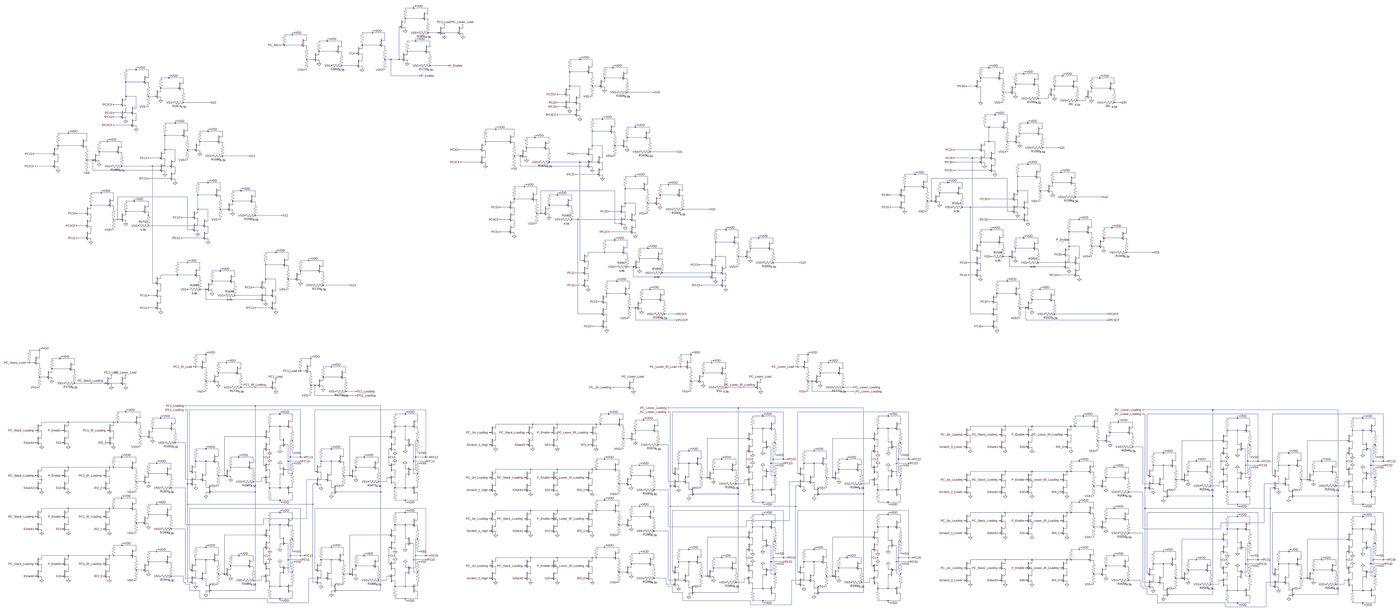
[diagram p0: schematic program_counter.asc, whole sheet]
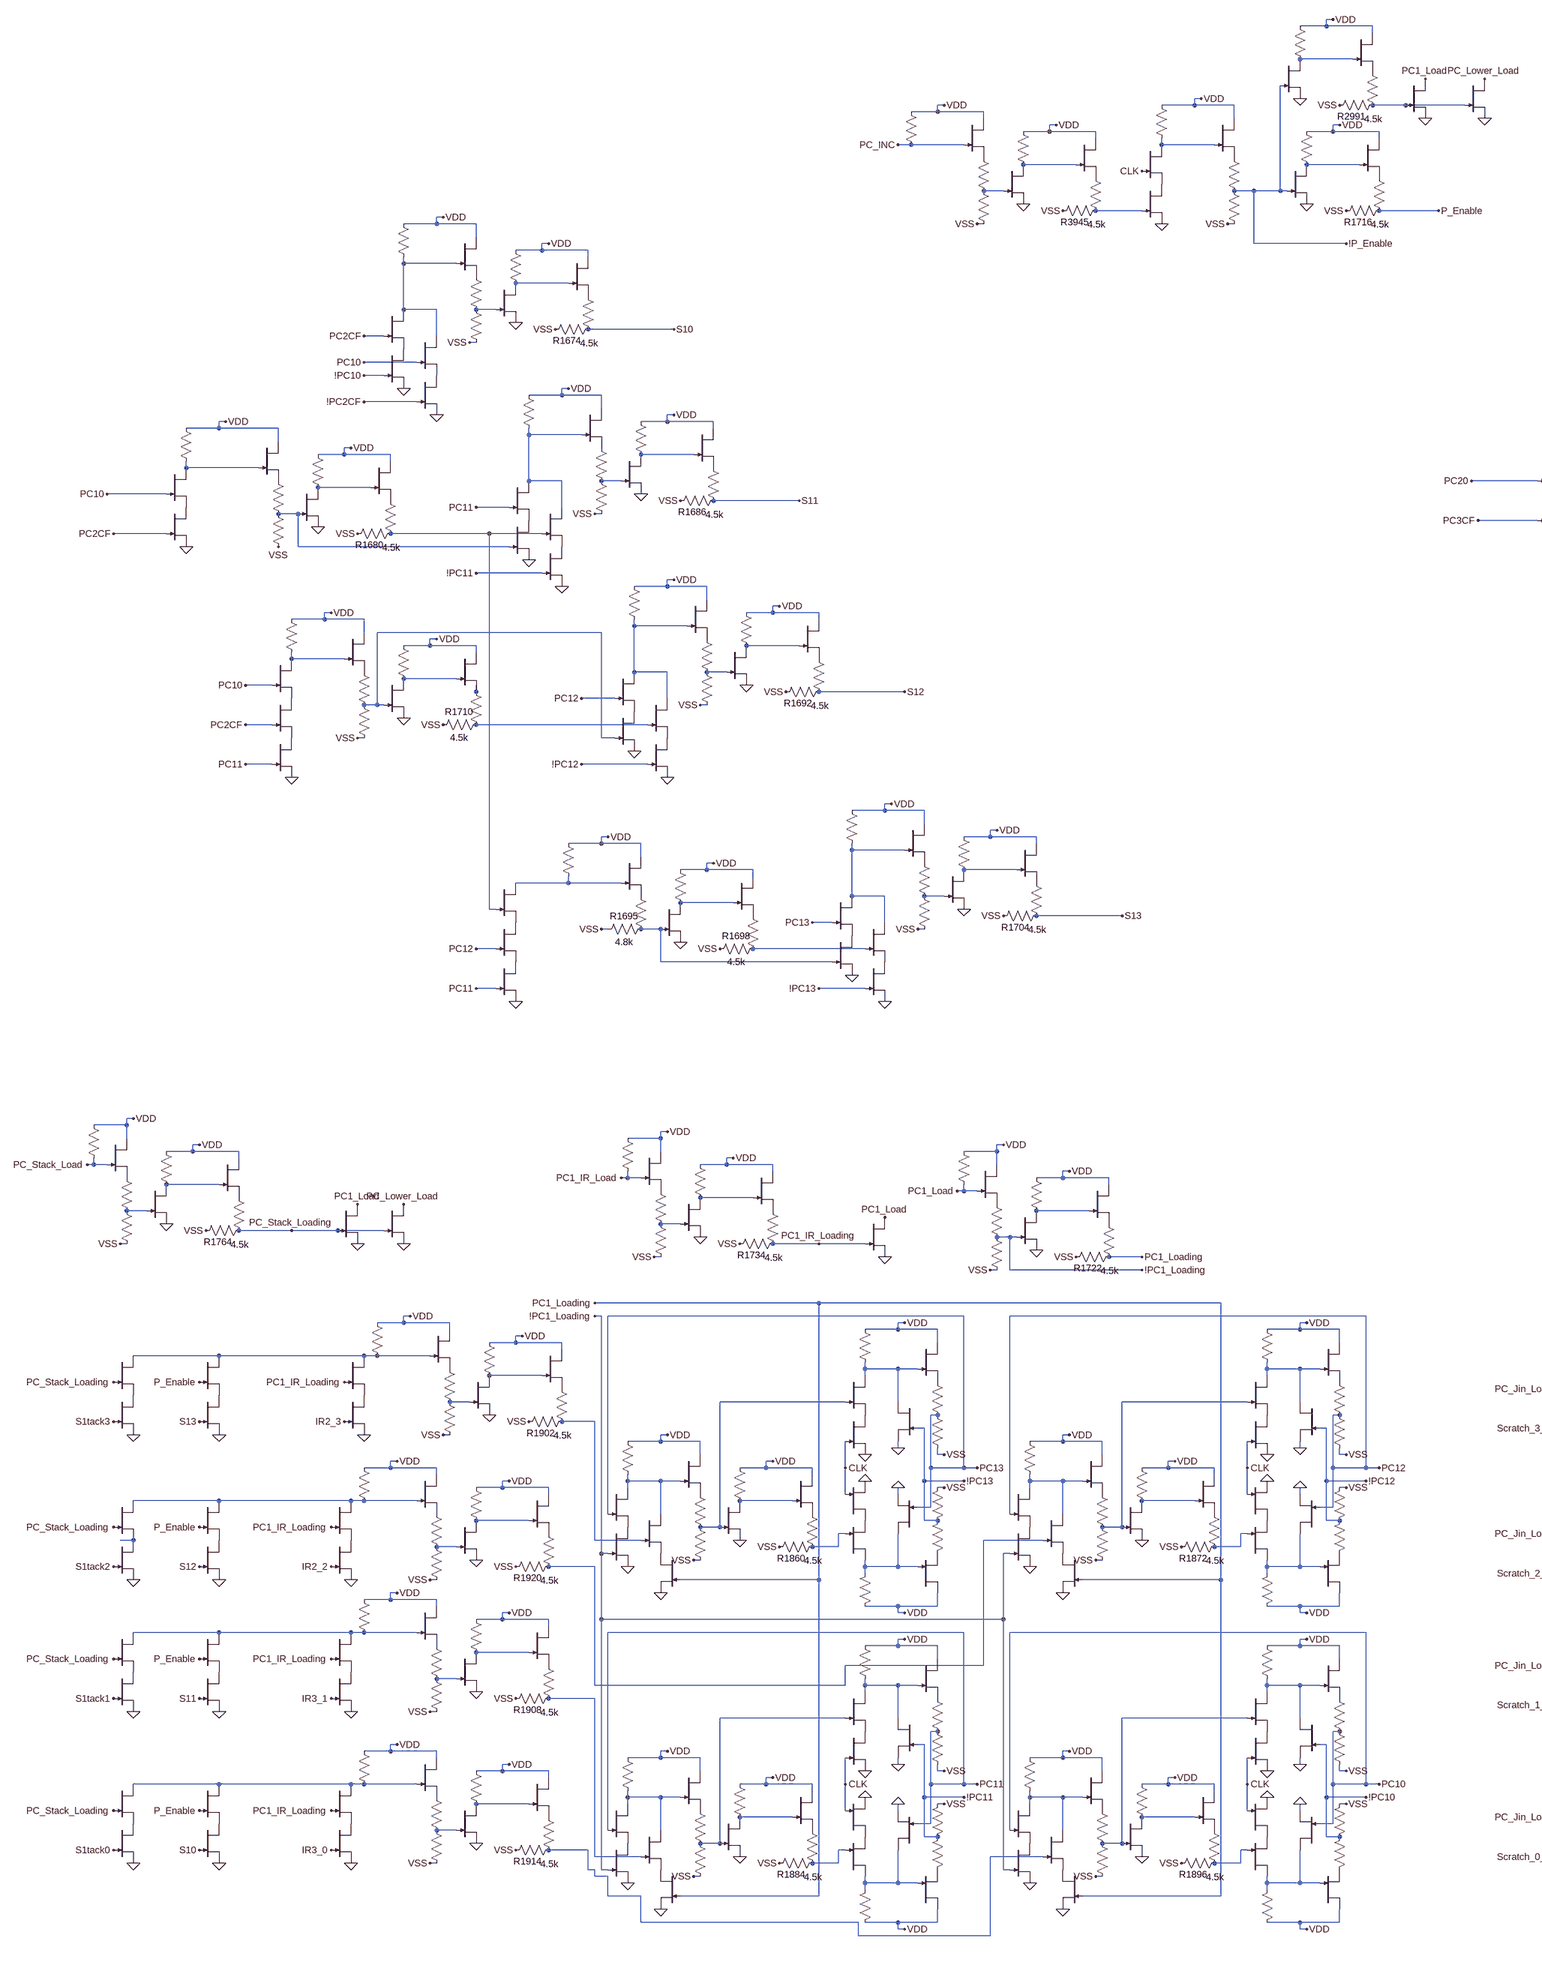
[diagram p1: schematic program_counter.asc, part, row 1 of 1, column 1 of 3]
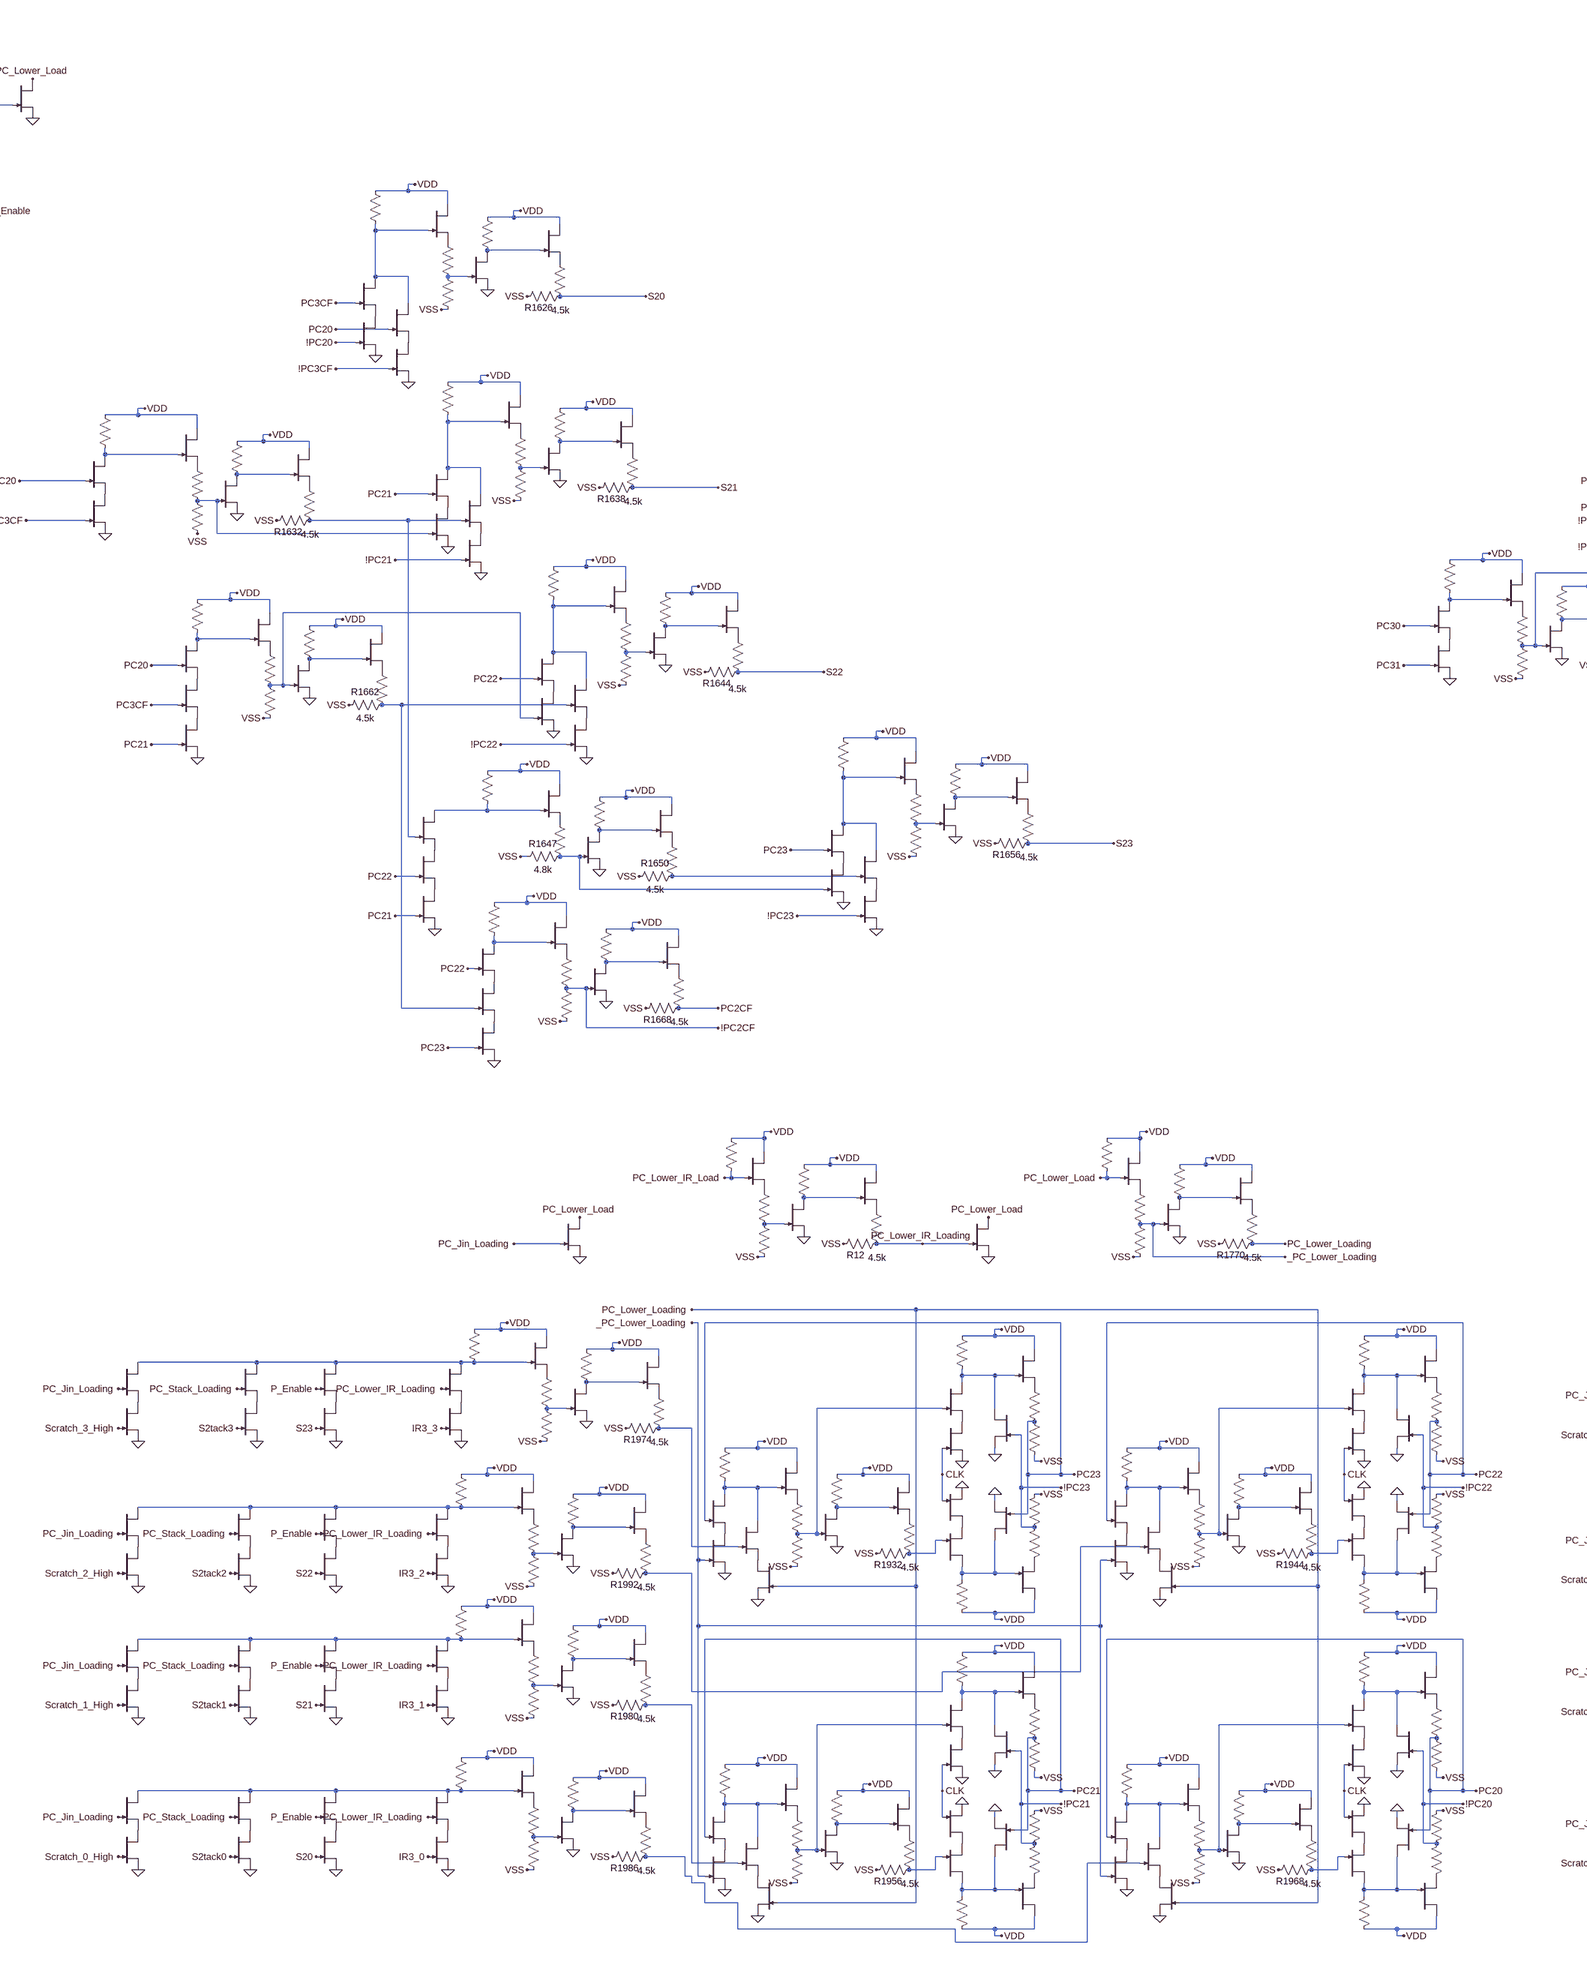
[diagram p2: schematic program_counter.asc, part, row 1 of 1, column 2 of 3]
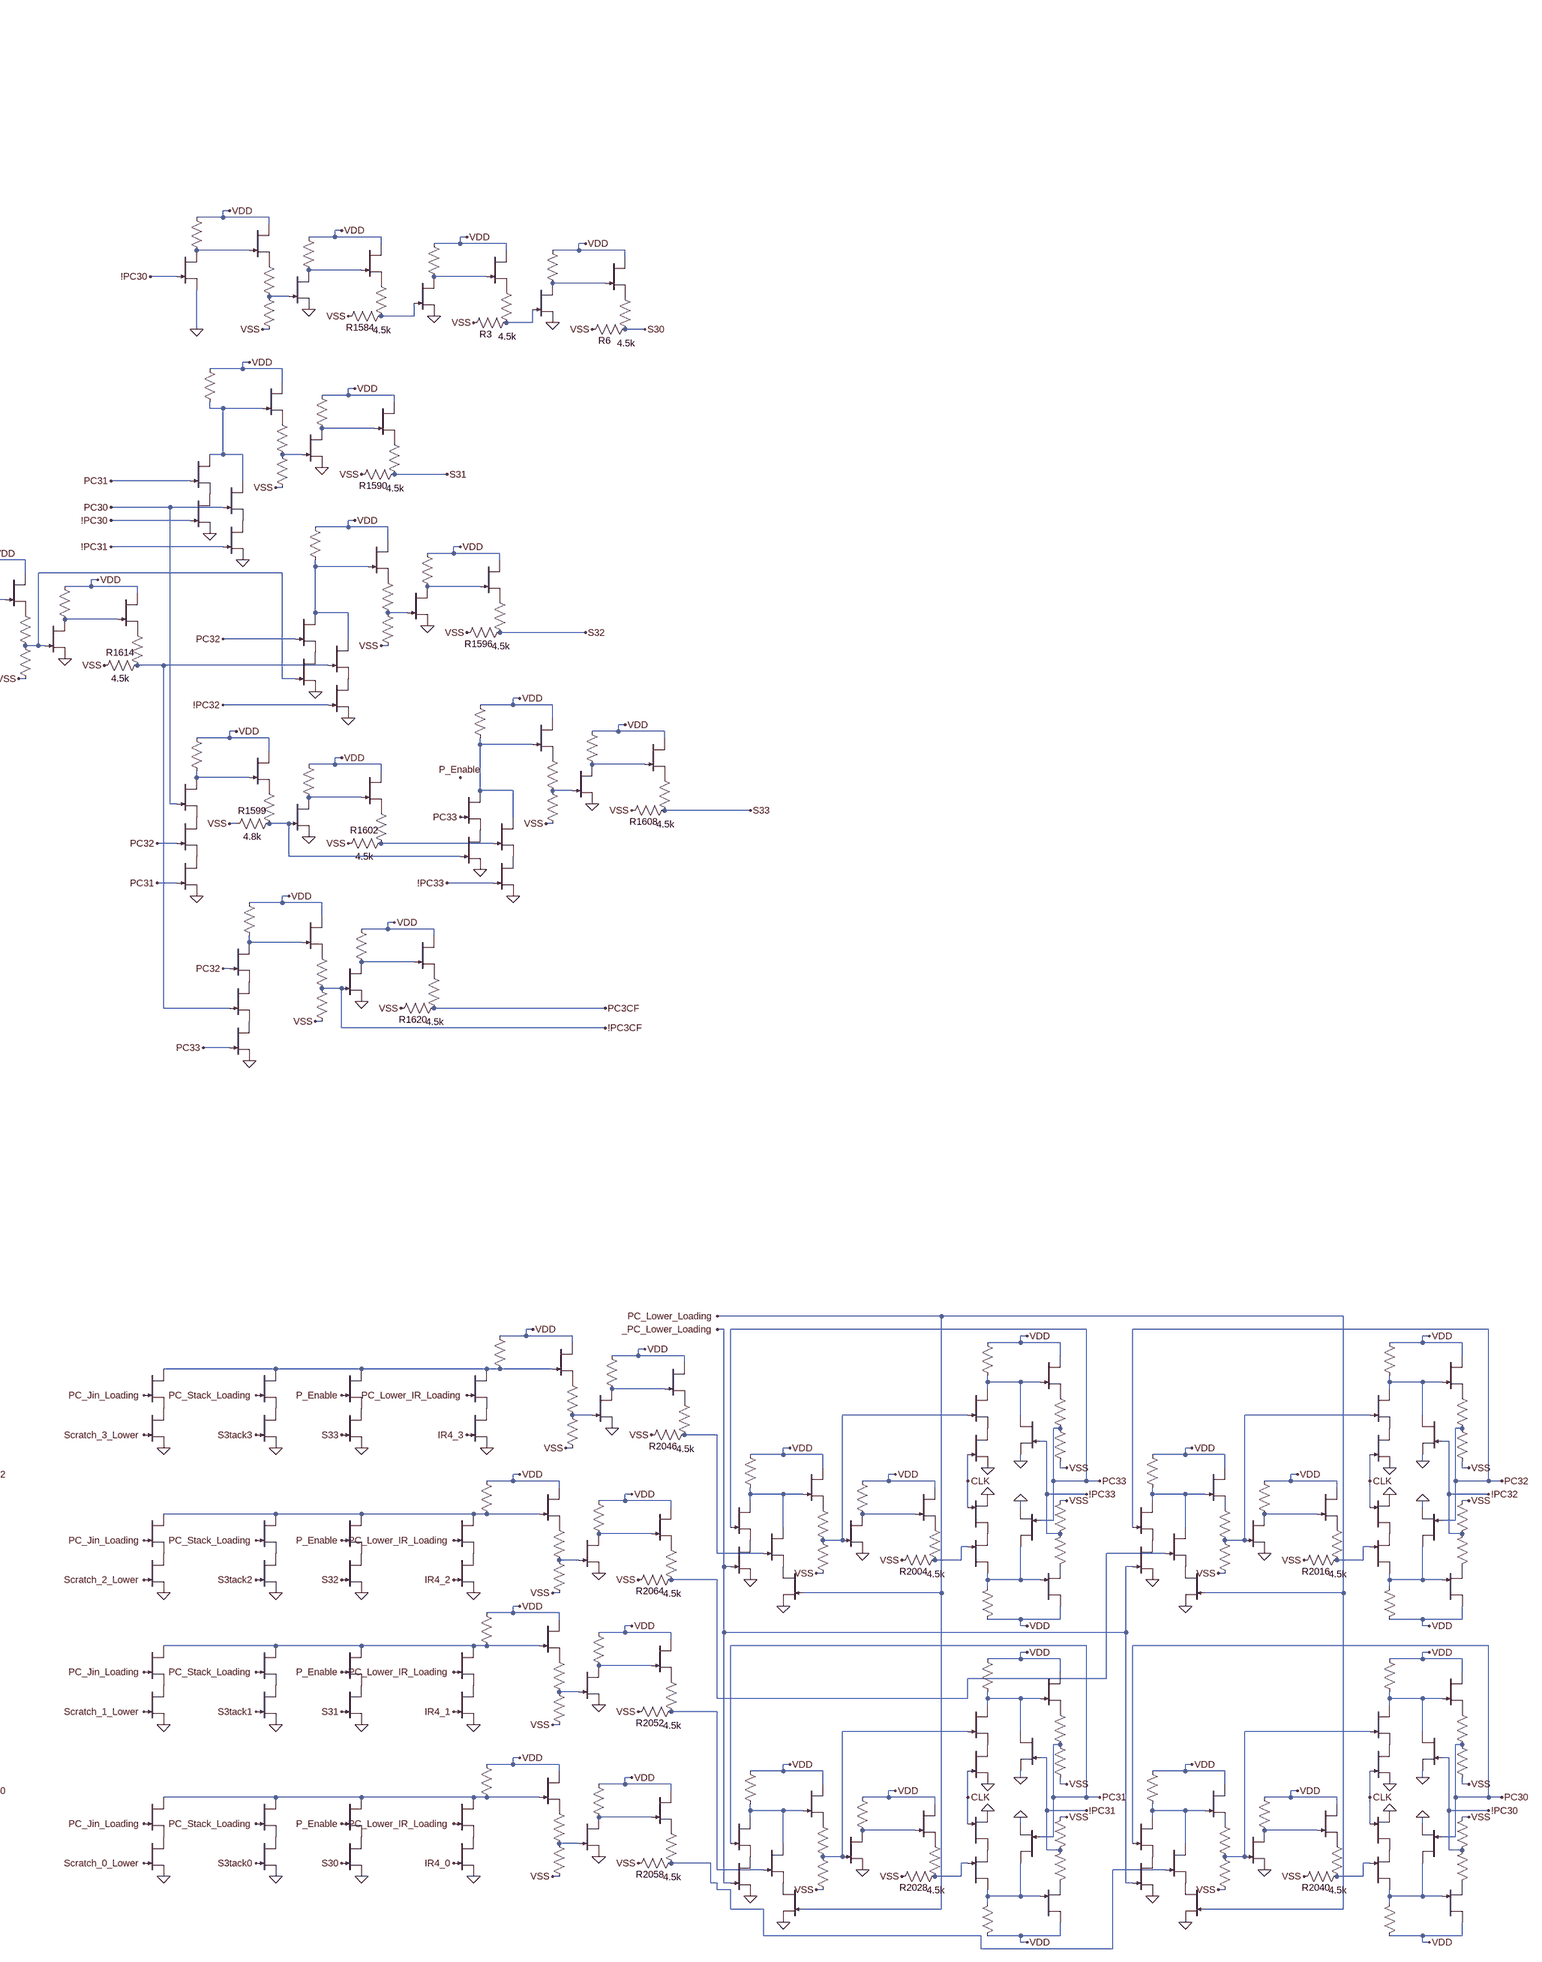
[diagram p3: schematic program_counter.asc, part, row 1 of 1, column 3 of 3]
* program_counter.asc
J_A1039 N010 !PC30 0 DR
R1579 VDD N010 100k
J_F392 VDD N010 P001 DR
R1580 P001 N017 1k
R1581 N017 VSS 4.8k
J_A1040 N012 N017 0 DR
R1582 VDD N012 50k
J_F393 VDD N012 P002 DR
R1583 P002 N019 1k
R1584 N019 VSS 4.5k
J_A1041 N021 PC31 P003 DR
R1585 VDD N021 100k
J_F394 VDD N021 P004 DR
R1586 P004 N028 1k
R1587 N028 VSS 4.8k
J_B497 N021 PC30 P005 DR
J_A1042 N023 N028 0 DR
R1588 VDD N023 50k
J_A1043 VDD N023 P006 DR
R1589 P006 S31 1k
R1590 S31 VSS 4.5k
J_A1044 P003 !PC30 0 DR
J_B498 P005 !PC31 0 DR
J_A1045 N038 PC32 P007 DR
R1591 VDD N038 100k
J_F395 VDD N038 P008 DR
R1592 P008 N044 1k
R1593 N044 VSS 4.8k
J_B499 N038 N054 P009 DR
J_A1046 N040 N044 0 DR
R1594 VDD N040 50k
J_A1047 VDD N040 P010 DR
R1595 P010 S32 1k
R1596 S32 VSS 4.5k
J_A1048 P007 N039 0 DR
J_B500 P009 !PC32 0 DR
R1597 VDD N063 100k
J_F396 VDD N063 P011 DR
R1598 P011 N069 1k
R1599 N069 VSS 4.8k
J_A1049 N066 N069 0 DR
R1600 VDD N066 50k
J_A1050 VDD N066 P012 DR
R1601 P012 N071 1k
R1602 N071 VSS 4.5k
J_A1051 P013 PC31 0 DR
J_B501 P014 PC32 P013 DR
J_B502 N063 PC30 P014 DR
J_A1052 N060 PC33 P015 DR
R1603 VDD N060 100k
J_F397 VDD N060 P016 DR
R1604 P016 N064 1k
R1605 N064 VSS 4.8k
J_B503 N060 N071 P017 DR
J_A1053 N061 N064 0 DR
R1606 VDD N061 50k
J_A1054 VDD N061 P018 DR
R1607 P018 S33 1k
R1608 S33 VSS 4.5k
J_A1055 P015 N069 0 DR
J_B504 P017 !PC33 0 DR
J_A1056 N041 PC30 P019 DR
R1609 VDD N041 100k
J_F398 VDD N041 P020 DR
R1610 P020 N039 1k
R1611 N039 VSS 4.8k
J_A1057 N045 N039 0 DR
R1612 VDD N045 50k
J_A1058 VDD N045 P021 DR
R1613 P021 N054 1k
R1614 N054 VSS 4.5k
J_B505 P019 PC31 0 DR
J_A1059 N081 PC32 P022 DR
J_B506 P022 N054 P023 DR
R1615 VDD N081 100k
J_F399 VDD N081 P024 DR
R1616 P024 !PC3CF 1k
R1617 !PC3CF VSS 4.8k
J_A1060 N084 !PC3CF 0 DR
R1618 VDD N084 50k
J_A1061 VDD N084 P025 DR
R1619 P025 PC3CF 1k
R1620 PC3CF VSS 4.5k
J_B507 P023 PC33 0 DR
J_A1062 N008 PC3CF P026 DR
R1621 VDD N008 100k
J_F400 VDD N008 P027 DR
R1622 P027 N013 1k
R1623 N013 VSS 4.8k
J_B508 N008 PC20 P028 DR
J_A1063 N009 N013 0 DR
R1624 VDD N009 50k
J_A1064 VDD N009 P029 DR
R1625 P029 S20 1k
R1626 S20 VSS 4.5k
J_A1065 P026 !PC20 0 DR
J_B509 P028 !PC3CF 0 DR
R1627 VDD N027 100k
J_F401 VDD N027 P030 DR
R1628 P030 N034 1k
R1629 N034 VSS 4.8k
J_A1066 N031 N034 0 DR
R1630 VDD N031 50k
J_A1067 VDD N031 P031 DR
R1631 P031 N036 1k
R1632 N036 VSS 4.5k
J_B510 N027 PC20 P032 DR
J_B511 P032 PC3CF 0 DR
J_A1068 N022 PC21 P033 DR
R1633 VDD N022 100k
J_F402 VDD N022 P034 DR
R1634 P034 N030 1k
R1635 N030 VSS 4.8k
J_B512 N022 N036 P035 DR
J_A1069 N025 N030 0 DR
R1636 VDD N025 50k
J_A1070 VDD N025 P036 DR
R1637 P036 S21 1k
R1638 S21 VSS 4.5k
J_A1071 P033 N034 0 DR
J_B513 P035 !PC21 0 DR
J_A1072 N042 PC22 P037 DR
R1639 VDD N042 100k
J_F403 VDD N042 P038 DR
R1640 P038 N051 1k
R1641 N051 VSS 4.8k
J_B514 N042 N058 P039 DR
J_A1073 N047 N051 0 DR
R1642 VDD N047 50k
J_A1074 VDD N047 P040 DR
R1643 P040 S22 1k
R1644 S22 VSS 4.5k
J_A1075 P037 N043 0 DR
J_B515 P039 !PC22 0 DR
R1645 VDD N067 100k
J_F404 VDD N067 P041 DR
R1646 P041 N073 1k
R1647 N073 VSS 4.8k
J_A1076 N070 N073 0 DR
R1648 VDD N070 50k
J_A1077 VDD N070 P042 DR
R1649 P042 N075 1k
R1650 N075 VSS 4.5k
J_A1078 P043 PC21 0 DR
J_B516 P044 PC22 P043 DR
J_B517 N067 N036 P044 DR
J_A1079 N062 PC23 P045 DR
R1651 VDD N062 100k
J_F405 VDD N062 P046 DR
R1652 P046 N068 1k
R1653 N068 VSS 4.8k
J_B518 N062 N075 P047 DR
J_A1080 N065 N068 0 DR
R1654 VDD N065 50k
J_A1081 VDD N065 P048 DR
R1655 P048 S23 1k
R1656 S23 VSS 4.5k
J_A1082 P045 N073 0 DR
J_B519 P047 !PC23 0 DR
J_A1083 N049 PC20 P049 DR
J_B520 P049 PC3CF P050 DR
R1657 VDD N049 100k
J_F406 VDD N049 P051 DR
R1658 P051 N043 1k
R1659 N043 VSS 4.8k
J_A1084 N053 N043 0 DR
R1660 VDD N053 50k
J_A1085 VDD N053 P052 DR
R1661 P052 N058 1k
R1662 N058 VSS 4.5k
J_B521 P050 PC21 0 DR
J_A1086 N080 PC22 P053 DR
J_B522 P053 N058 P054 DR
R1663 VDD N080 100k
J_F407 VDD N080 P055 DR
R1664 P055 !PC2CF 1k
R1665 !PC2CF VSS 4.8k
J_A1087 N083 !PC2CF 0 DR
R1666 VDD N083 50k
J_A1088 VDD N083 P056 DR
R1667 P056 PC2CF 1k
R1668 PC2CF VSS 4.5k
J_B523 P054 PC23 0 DR
J_A1089 N011 PC2CF P057 DR
R1669 VDD N011 100k
J_F408 VDD N011 P058 DR
R1670 P058 N018 1k
R1671 N018 VSS 4.8k
J_B524 N011 PC10 P059 DR
J_A1090 N015 N018 0 DR
R1672 VDD N015 50k
J_A1091 VDD N015 P060 DR
R1673 P060 S10 1k
R1674 S10 VSS 4.5k
J_A1092 P057 !PC10 0 DR
J_B525 P059 !PC2CF 0 DR
R1675 VDD N029 100k
J_F409 VDD N029 P061 DR
R1676 P061 N035 1k
R1677 N035 VSS 4.8k
J_A1093 N033 N035 0 DR
R1678 VDD N033 50k
J_A1094 VDD N033 P062 DR
R1679 P062 N037 1k
R1680 N037 VSS 4.5k
J_B526 N029 PC10 P063 DR
J_B527 P063 PC2CF 0 DR
J_A1095 N024 PC11 P064 DR
R1681 VDD N024 100k
J_F410 VDD N024 P065 DR
R1682 P065 N032 1k
R1683 N032 VSS 4.8k
J_B528 N024 N037 P066 DR
J_A1096 N026 N032 0 DR
R1684 VDD N026 50k
J_A1097 VDD N026 P067 DR
R1685 P067 S11 1k
R1686 S11 VSS 4.5k
J_A1098 P064 N035 0 DR
J_B529 P066 !PC11 0 DR
J_A1099 N046 PC12 P068 DR
R1687 VDD N046 100k
J_F411 VDD N046 P069 DR
R1688 P069 N055 1k
R1689 N055 VSS 4.8k
J_B530 N046 N059 P070 DR
J_A1100 N050 N055 0 DR
R1690 VDD N050 50k
J_A1101 VDD N050 P071 DR
R1691 P071 S12 1k
R1692 S12 VSS 4.5k
J_A1102 P068 N048 0 DR
J_B531 P070 !PC12 0 DR
R1693 VDD N076 100k
J_F412 VDD N076 P072 DR
R1694 P072 N079 1k
R1695 N079 VSS 4.8k
J_A1103 N078 N079 0 DR
R1696 VDD N078 50k
J_A1104 VDD N078 P073 DR
R1697 P073 N082 1k
R1698 N082 VSS 4.5k
J_A1105 P074 PC11 0 DR
J_B532 P075 PC12 P074 DR
J_B533 N076 N037 P075 DR
J_A1106 N072 PC13 P076 DR
R1699 VDD N072 100k
J_F413 VDD N072 P077 DR
R1700 P077 N077 1k
R1701 N077 VSS 4.8k
J_B534 N072 N082 P078 DR
J_A1107 N074 N077 0 DR
R1702 VDD N074 50k
J_A1108 VDD N074 P079 DR
R1703 P079 S13 1k
R1704 S13 VSS 4.5k
J_A1109 P076 N079 0 DR
J_B535 P078 !PC13 0 DR
J_A1110 N052 PC10 P080 DR
J_B536 P080 PC2CF P081 DR
R1705 VDD N052 100k
J_F414 VDD N052 P082 DR
R1706 P082 N048 1k
R1707 N048 VSS 4.8k
J_A1111 N056 N048 0 DR
R1708 VDD N056 50k
J_A1112 VDD N056 N057 DR
R1709 N057 N059 1k
R1710 N059 VSS 4.5k
J_B537 P081 PC11 0 DR
R1711 VDD N003 100k
J_F415 VDD N003 P083 DR
R1712 P083 !P_Enable 1k
R1713 !P_Enable VSS 4.8k
J_A1113 PC1_Load N002 0 DR
J_A1114 PC_Lower_Load N002 0 DR
J_A1116 N005 !P_Enable 0 DR
R1714 VDD N005 50k
J_A1117 VDD N005 P084 DR
R1715 P084 P_Enable 1k
R1716 P_Enable VSS 4.5k
R1717 VDD PC1_Load 100k
J_F416 VDD PC1_Load P085 DR
R1718 P085 !PC1_Loading 1k
R1719 !PC1_Loading VSS 4.8k
J_A1142 N090 !PC1_Loading 0 DR
R1720 VDD N090 50k
J_A1143 VDD N090 P086 DR
R1721 P086 PC1_Loading 1k
R1722 PC1_Loading VSS 4.5k
R1729 VDD PC1_IR_Load 100k
J_F418 VDD PC1_IR_Load P087 DR
R1730 P087 N091 1k
R1731 N091 VSS 4.8k
J_A1146 N086 N091 0 DR
R1732 VDD N086 50k
J_A1147 VDD N086 P088 DR
R1733 P088 PC1_IR_Loading 1k
R1734 PC1_IR_Loading VSS 4.5k
J_A1148 PC1_Load PC1_IR_Loading 0 DR
R1759 VDD PC_Stack_Load 100k
J_F423 VDD PC_Stack_Load P089 DR
R1760 P089 N089 1k
R1761 N089 VSS 4.8k
J_A1157 N085 N089 0 DR
R1762 VDD N085 50k
J_A1158 VDD N085 P090 DR
R1763 P090 PC_Stack_Loading 1k
R1764 PC_Stack_Loading VSS 4.5k
J_A1159 PC1_Load PC_Stack_Loading 0 DR
R1765 VDD PC_Lower_Load 100k
J_F424 VDD PC_Lower_Load P091 DR
R1766 P091 _PC_Lower_Loading 1k
R1767 _PC_Lower_Loading VSS 4.8k
J_A1160 N088 _PC_Lower_Loading 0 DR
R1768 VDD N088 50k
J_A1161 VDD N088 P092 DR
R1769 P092 PC_Lower_Loading 1k
R1770 PC_Lower_Loading VSS 4.5k
J_A1190 PC_Lower_Load PC_Stack_Loading 0 DR
J_A1192 N095 N106 P093 DR
R1849 VDD N095 100k
J_F438 VDD N095 P094 DR
R1850 P094 PC13 1k
R1851 PC13 VSS 4.8k
J_B538 N095 !PC13 0 DR
J_A1193 N148 N134 P095 DR
R1852 VDD N148 100k
J_F439 VDD N148 P096 DR
R1853 P096 !PC13 1k
R1854 !PC13 VSS 4.8k
J_B539 N148 PC13 0 DR
J_A1194 P093 CLK 0 DR
J_A1195 P095 CLK 0 DR
J_A1196 N117 PC13 P097 DR
R1855 VDD N117 100k
J_F440 VDD N117 P098 DR
R1856 P098 N106 1k
R1857 N106 VSS 4.8k
J_B540 N117 N114 P099 DR
J_A1197 N124 N106 0 DR
R1858 VDD N124 50k
J_A1198 VDD N124 P100 DR
R1859 P100 N134 1k
R1860 N134 VSS 4.5k
J_A1199 P097 !PC1_Loading 0 DR
J_B541 P099 PC1_Loading 0 DR
J_A1200 N096 N107 P101 DR
R1861 VDD N096 100k
J_F441 VDD N096 P102 DR
R1862 P102 PC12 1k
R1863 PC12 VSS 4.8k
J_B542 N096 !PC12 0 DR
J_A1201 N149 N135 P103 DR
R1864 VDD N149 100k
J_F442 VDD N149 P104 DR
R1865 P104 !PC12 1k
R1866 !PC12 VSS 4.8k
J_B543 N149 PC12 0 DR
J_A1202 P101 CLK 0 DR
J_A1203 P103 CLK 0 DR
J_A1204 N118 PC12 P105 DR
R1867 VDD N118 100k
J_F443 VDD N118 P106 DR
R1868 P106 N107 1k
R1869 N107 VSS 4.8k
J_B544 N118 N138 P107 DR
J_A1205 N125 N107 0 DR
R1870 VDD N125 50k
J_A1206 VDD N125 P108 DR
R1871 P108 N135 1k
R1872 N135 VSS 4.5k
J_A1207 P105 !PC1_Loading 0 DR
J_B545 P107 PC1_Loading 0 DR
J_A1208 N161 N172 P109 DR
R1873 VDD N161 100k
J_F444 VDD N161 P110 DR
R1874 P110 PC11 1k
R1875 PC11 VSS 4.8k
J_B546 N161 !PC11 0 DR
J_A1209 N208 N200 P111 DR
R1876 VDD N208 100k
J_F445 VDD N208 P112 DR
R1877 P112 !PC11 1k
R1878 !PC11 VSS 4.8k
J_B547 N208 PC11 0 DR
J_A1210 P109 CLK 0 DR
J_A1211 P111 CLK 0 DR
J_A1212 N180 PC11 P113 DR
R1879 VDD N180 100k
J_F446 VDD N180 P114 DR
R1880 P114 N172 1k
R1881 N172 VSS 4.8k
J_B548 N180 N167 P115 DR
J_A1213 N189 N172 0 DR
R1882 VDD N189 50k
J_A1214 VDD N189 P116 DR
R1883 P116 N200 1k
R1884 N200 VSS 4.5k
J_A1215 P113 !PC1_Loading 0 DR
J_B549 P115 PC1_Loading 0 DR
J_A1216 N162 N173 P117 DR
R1885 VDD N162 100k
J_F447 VDD N162 P118 DR
R1886 P118 PC10 1k
R1887 PC10 VSS 4.8k
J_B550 N162 !PC10 0 DR
J_A1217 N209 N201 P119 DR
R1888 VDD N209 100k
J_F448 VDD N209 P120 DR
R1889 P120 !PC10 1k
R1890 !PC10 VSS 4.8k
J_B551 N209 PC10 0 DR
J_A1218 P117 CLK 0 DR
J_A1219 P119 CLK 0 DR
J_A1220 N181 PC10 P121 DR
R1891 VDD N181 100k
J_F449 VDD N181 P122 DR
R1892 P122 N173 1k
R1893 N173 VSS 4.8k
J_B552 N181 N199 P123 DR
J_A1221 N190 N173 0 DR
R1894 VDD N190 50k
J_A1222 VDD N190 P124 DR
R1895 P124 N201 1k
R1896 N201 VSS 4.5k
J_A1223 P121 !PC1_Loading 0 DR
J_B553 P123 PC1_Loading 0 DR
J_A1224 N093 PC1_IR_Loading P125 DR
R1897 VDD N093 100k
J_F450 VDD N093 P126 DR
R1898 P126 N105 1k
R1899 N105 VSS 4.8k
J_B554 P125 IR2_3 0 DR
J_A1225 N098 N105 0 DR
R1900 VDD N098 50k
J_F451 VDD N098 P127 DR
R1901 P127 N114 1k
R1902 N114 VSS 4.5k
J_A1226 N154 PC1_IR_Loading P128 DR
R1903 VDD N154 100k
J_F452 VDD N154 P129 DR
R1904 P129 N160 1k
R1905 N160 VSS 4.8k
J_B555 P128 IR3_1 0 DR
J_A1227 N157 N160 0 DR
R1906 VDD N157 50k
J_F453 VDD N157 P130 DR
R1907 P130 N167 1k
R1908 N167 VSS 4.5k
J_A1228 N178 PC1_IR_Loading P131 DR
R1909 VDD N178 100k
J_F454 VDD N178 P132 DR
R1910 P132 N194 1k
R1911 N194 VSS 4.8k
J_B556 P131 IR3_0 0 DR
J_A1229 N183 N194 0 DR
R1912 VDD N183 50k
J_F455 VDD N183 P133 DR
R1913 P133 N199 1k
R1914 N199 VSS 4.5k
J_A1230 N123 PC1_IR_Loading P134 DR
R1915 VDD N123 100k
J_F456 VDD N123 P135 DR
R1916 P135 N141 1k
R1917 N141 VSS 4.8k
J_B557 P134 IR2_2 0 DR
J_A1231 N132 N141 0 DR
R1918 VDD N132 50k
J_F457 VDD N132 P136 DR
R1919 P136 N138 1k
R1920 N138 VSS 4.5k
J_A1232 N093 PC_Stack_Loading P137 DR
J_B558 P137 S1tack3 0 DR
J_A1233 N123 PC_Stack_Loading N137 DR
J_B559 N137 S1tack2 0 DR
J_A1234 N154 PC_Stack_Loading P138 DR
J_B560 P138 S1tack1 0 DR
J_A1235 N178 PC_Stack_Loading P139 DR
J_B561 P139 S1tack0 0 DR
J_A1236 N093 P_Enable P140 DR
J_B562 P140 S13 0 DR
J_A1237 N123 P_Enable P141 DR
J_B563 P141 S12 0 DR
J_A1238 N154 P_Enable P142 DR
J_B564 P142 S11 0 DR
J_A1239 N178 P_Enable P143 DR
J_B565 P143 S10 0 DR
J_A1240 N099 N109 P144 DR
R1921 VDD N099 100k
J_F458 VDD N099 P145 DR
R1922 P145 PC23 1k
R1923 PC23 VSS 4.8k
J_B566 N099 !PC23 0 DR
J_A1241 N150 N139 P146 DR
R1924 VDD N150 100k
J_F459 VDD N150 P147 DR
R1925 P147 !PC23 1k
R1926 !PC23 VSS 4.8k
J_B567 N150 PC23 0 DR
J_A1242 P144 CLK 0 DR
J_A1243 P146 CLK 0 DR
J_A1244 N119 PC23 P148 DR
R1927 VDD N119 100k
J_F460 VDD N119 P149 DR
R1928 P149 N109 1k
R1929 N109 VSS 4.8k
J_B568 N119 N115 P150 DR
J_A1245 N127 N109 0 DR
R1930 VDD N127 50k
J_A1246 VDD N127 P151 DR
R1931 P151 N139 1k
R1932 N139 VSS 4.5k
J_A1247 P148 _PC_Lower_Loading 0 DR
J_B569 P150 PC_Lower_Loading 0 DR
J_A1248 N100 N110 P152 DR
R1933 VDD N100 100k
J_F461 VDD N100 P153 DR
R1934 P153 PC22 1k
R1935 PC22 VSS 4.8k
J_B570 N100 !PC22 0 DR
J_A1249 N151 N140 P154 DR
R1936 VDD N151 100k
J_F462 VDD N151 P155 DR
R1937 P155 !PC22 1k
R1938 !PC22 VSS 4.8k
J_B571 N151 PC22 0 DR
J_A1250 P152 CLK 0 DR
J_A1251 P154 CLK 0 DR
J_A1252 N120 PC22 P156 DR
R1939 VDD N120 100k
J_F463 VDD N120 P157 DR
R1940 P157 N110 1k
R1941 N110 VSS 4.8k
J_B572 N120 N142 P158 DR
J_A1253 N128 N110 0 DR
R1942 VDD N128 50k
J_A1254 VDD N128 P159 DR
R1943 P159 N140 1k
R1944 N140 VSS 4.5k
J_A1255 P156 _PC_Lower_Loading 0 DR
J_B573 P158 PC_Lower_Loading 0 DR
J_A1256 N164 N174 P160 DR
R1945 VDD N164 100k
J_F464 VDD N164 P161 DR
R1946 P161 PC21 1k
R1947 PC21 VSS 4.8k
J_B574 N164 !PC21 0 DR
J_A1257 N210 N203 P162 DR
R1948 VDD N210 100k
J_F465 VDD N210 P163 DR
R1949 P163 !PC21 1k
R1950 !PC21 VSS 4.8k
J_B575 N210 PC21 0 DR
J_A1258 P160 CLK 0 DR
J_A1259 P162 CLK 0 DR
J_A1260 N184 PC21 P164 DR
R1951 VDD N184 100k
J_F466 VDD N184 P165 DR
R1952 P165 N174 1k
R1953 N174 VSS 4.8k
J_B576 N184 N170 P166 DR
J_A1261 N192 N174 0 DR
R1954 VDD N192 50k
J_A1262 VDD N192 P167 DR
R1955 P167 N203 1k
R1956 N203 VSS 4.5k
J_A1263 P164 _PC_Lower_Loading 0 DR
J_B577 P166 PC_Lower_Loading 0 DR
J_A1264 N165 N175 P168 DR
R1957 VDD N165 100k
J_F467 VDD N165 P169 DR
R1958 P169 PC20 1k
R1959 PC20 VSS 4.8k
J_B578 N165 !PC20 0 DR
J_A1265 N211 N204 P170 DR
R1960 VDD N211 100k
J_F468 VDD N211 P171 DR
R1961 P171 !PC20 1k
R1962 !PC20 VSS 4.8k
J_B579 N211 PC20 0 DR
J_A1266 P168 CLK 0 DR
J_A1267 P170 CLK 0 DR
J_A1268 N185 PC20 P172 DR
R1963 VDD N185 100k
J_F469 VDD N185 P173 DR
R1964 P173 N175 1k
R1965 N175 VSS 4.8k
J_B580 N185 N202 P174 DR
J_A1269 N193 N175 0 DR
R1966 VDD N193 50k
J_A1270 VDD N193 P175 DR
R1967 P175 N204 1k
R1968 N204 VSS 4.5k
J_A1271 P172 _PC_Lower_Loading 0 DR
J_B581 P174 PC_Lower_Loading 0 DR
J_A1272 N094 PC_Lower_IR_Loading P176 DR
R1969 VDD N094 100k
J_F470 VDD N094 P177 DR
R1970 P177 N108 1k
R1971 N108 VSS 4.8k
J_B582 P176 IR3_3 0 DR
J_A1273 N101 N108 0 DR
R1972 VDD N101 50k
J_F471 VDD N101 P178 DR
R1973 P178 N115 1k
R1974 N115 VSS 4.5k
J_A1274 N155 PC_Lower_IR_Loading P179 DR
R1975 VDD N155 100k
J_F472 VDD N155 P180 DR
R1976 P180 N163 1k
R1977 N163 VSS 4.8k
J_B583 P179 IR3_1 0 DR
J_A1275 N158 N163 0 DR
R1978 VDD N158 50k
J_F473 VDD N158 P181 DR
R1979 P181 N170 1k
R1980 N170 VSS 4.5k
J_A1276 N179 PC_Lower_IR_Loading P182 DR
R1981 VDD N179 100k
J_F474 VDD N179 P183 DR
R1982 P183 N197 1k
R1983 N197 VSS 4.8k
J_B584 P182 IR3_0 0 DR
J_A1277 N186 N197 0 DR
R1984 VDD N186 50k
J_F475 VDD N186 P184 DR
R1985 P184 N202 1k
R1986 N202 VSS 4.5k
J_A1278 N126 PC_Lower_IR_Loading P185 DR
R1987 VDD N126 100k
J_F476 VDD N126 P186 DR
R1988 P186 N145 1k
R1989 N145 VSS 4.8k
J_B585 P185 IR3_2 0 DR
J_A1279 N133 N145 0 DR
R1990 VDD N133 50k
J_F477 VDD N133 P187 DR
R1991 P187 N142 1k
R1992 N142 VSS 4.5k
J_A1280 N094 PC_Stack_Loading P188 DR
J_B586 P188 S2tack3 0 DR
J_A1281 N126 PC_Stack_Loading P189 DR
J_B587 P189 S2tack2 0 DR
J_A1282 N155 PC_Stack_Loading P190 DR
J_B588 P190 S2tack1 0 DR
J_A1283 N179 PC_Stack_Loading P191 DR
J_B589 P191 S2tack0 0 DR
J_A1284 N102 N112 P192 DR
R1993 VDD N102 100k
J_F478 VDD N102 P193 DR
R1994 P193 PC33 1k
R1995 PC33 VSS 4.8k
J_B590 N102 !PC33 0 DR
J_A1285 N152 N143 P194 DR
R1996 VDD N152 100k
J_F479 VDD N152 P195 DR
R1997 P195 !PC33 1k
R1998 !PC33 VSS 4.8k
J_B591 N152 PC33 0 DR
J_A1286 P192 CLK 0 DR
J_A1287 P194 CLK 0 DR
J_A1288 N121 PC33 P196 DR
R1999 VDD N121 100k
J_F480 VDD N121 P197 DR
R2000 P197 N112 1k
R2001 N112 VSS 4.8k
J_B592 N121 N116 P198 DR
J_A1289 N130 N112 0 DR
R2002 VDD N130 50k
J_A1290 VDD N130 P199 DR
R2003 P199 N143 1k
R2004 N143 VSS 4.5k
J_A1291 P196 _PC_Lower_Loading 0 DR
J_B593 P198 PC_Lower_Loading 0 DR
J_A1292 N103 N113 P200 DR
R2005 VDD N103 100k
J_F481 VDD N103 P201 DR
R2006 P201 PC32 1k
R2007 PC32 VSS 4.8k
J_B594 N103 !PC32 0 DR
J_A1293 N153 N144 P202 DR
R2008 VDD N153 100k
J_F482 VDD N153 P203 DR
R2009 P203 !PC32 1k
R2010 !PC32 VSS 4.8k
J_B595 N153 PC32 0 DR
J_A1294 P200 CLK 0 DR
J_A1295 P202 CLK 0 DR
J_A1296 N122 PC32 P204 DR
R2011 VDD N122 100k
J_F483 VDD N122 P205 DR
R2012 P205 N113 1k
R2013 N113 VSS 4.8k
J_B596 N122 N146 P206 DR
J_A1297 N131 N113 0 DR
R2014 VDD N131 50k
J_A1298 VDD N131 P207 DR
R2015 P207 N144 1k
R2016 N144 VSS 4.5k
J_A1299 P204 _PC_Lower_Loading 0 DR
J_B597 P206 PC_Lower_Loading 0 DR
J_A1300 N168 N176 P208 DR
R2017 VDD N168 100k
J_F484 VDD N168 P209 DR
R2018 P209 PC31 1k
R2019 PC31 VSS 4.8k
J_B598 N168 !PC31 0 DR
J_A1301 N212 N206 P210 DR
R2020 VDD N212 100k
J_F485 VDD N212 P211 DR
R2021 P211 !PC31 1k
R2022 !PC31 VSS 4.8k
J_B599 N212 PC31 0 DR
J_A1302 P208 CLK 0 DR
J_A1303 P210 CLK 0 DR
J_A1304 N187 PC31 P212 DR
R2023 VDD N187 100k
J_F486 VDD N187 P213 DR
R2024 P213 N176 1k
R2025 N176 VSS 4.8k
J_B600 N187 N171 P214 DR
J_A1305 N195 N176 0 DR
R2026 VDD N195 50k
J_A1306 VDD N195 P215 DR
R2027 P215 N206 1k
R2028 N206 VSS 4.5k
J_A1307 P212 _PC_Lower_Loading 0 DR
J_B601 P214 PC_Lower_Loading 0 DR
J_A1308 N169 N177 P216 DR
R2029 VDD N169 100k
J_F487 VDD N169 P217 DR
R2030 P217 PC30 1k
R2031 PC30 VSS 4.8k
J_B602 N169 !PC30 0 DR
J_A1309 N213 N207 P218 DR
R2032 VDD N213 100k
J_F488 VDD N213 P219 DR
R2033 P219 !PC30 1k
R2034 !PC30 VSS 4.8k
J_B603 N213 PC30 0 DR
J_A1310 P216 CLK 0 DR
J_A1311 P218 CLK 0 DR
J_A1312 N188 PC30 P220 DR
R2035 VDD N188 100k
J_F489 VDD N188 P221 DR
R2036 P221 N177 1k
R2037 N177 VSS 4.8k
J_B604 N188 N205 P222 DR
J_A1313 N196 N177 0 DR
R2038 VDD N196 50k
J_A1314 VDD N196 P223 DR
R2039 P223 N207 1k
R2040 N207 VSS 4.5k
J_A1315 P220 _PC_Lower_Loading 0 DR
J_B605 P222 PC_Lower_Loading 0 DR
J_A1316 N097 PC_Lower_IR_Loading P224 DR
R2041 VDD N097 100k
J_F490 VDD N097 P225 DR
R2042 P225 N111 1k
R2043 N111 VSS 4.8k
J_B606 P224 IR4_3 0 DR
J_A1317 N104 N111 0 DR
R2044 VDD N104 50k
J_F491 VDD N104 P226 DR
R2045 P226 N116 1k
R2046 N116 VSS 4.5k
J_A1318 N156 PC_Lower_IR_Loading P227 DR
R2047 VDD N156 100k
J_F492 VDD N156 P228 DR
R2048 P228 N166 1k
R2049 N166 VSS 4.8k
J_B607 P227 IR4_1 0 DR
J_A1319 N159 N166 0 DR
R2050 VDD N159 50k
J_F493 VDD N159 P229 DR
R2051 P229 N171 1k
R2052 N171 VSS 4.5k
J_A1320 N182 PC_Lower_IR_Loading P230 DR
R2053 VDD N182 100k
J_F494 VDD N182 P231 DR
R2054 P231 N198 1k
R2055 N198 VSS 4.8k
J_B608 P230 IR4_0 0 DR
J_A1321 N191 N198 0 DR
R2056 VDD N191 50k
J_F495 VDD N191 P232 DR
R2057 P232 N205 1k
R2058 N205 VSS 4.5k
J_A1322 N129 PC_Lower_IR_Loading P233 DR
R2059 VDD N129 100k
J_F496 VDD N129 P234 DR
R2060 P234 N147 1k
R2061 N147 VSS 4.8k
J_B609 P233 IR4_2 0 DR
J_A1323 N136 N147 0 DR
R2062 VDD N136 50k
J_F497 VDD N136 P235 DR
R2063 P235 N146 1k
R2064 N146 VSS 4.5k
J_A1324 N097 PC_Stack_Loading P236 DR
J_B610 P236 S3tack3 0 DR
J_A1325 N129 PC_Stack_Loading P237 DR
J_B611 P237 S3tack2 0 DR
J_A1326 N156 PC_Stack_Loading P238 DR
J_B612 P238 S3tack1 0 DR
J_A1327 N182 PC_Stack_Loading P239 DR
J_B613 P239 S3tack0 0 DR
J_A1328 N094 P_Enable P240 DR
J_B614 P240 S23 0 DR
J_A1329 N126 P_Enable P241 DR
J_B615 P241 S22 0 DR
J_A1330 N155 P_Enable P242 DR
J_B616 P242 S21 0 DR
J_A1331 N179 P_Enable P243 DR
J_B617 P243 S20 0 DR
J_A1332 N097 P_Enable P244 DR
J_B618 P244 S33 0 DR
J_A1333 N129 P_Enable P245 DR
J_B619 P245 S32 0 DR
J_A1334 N156 P_Enable P246 DR
J_B620 P246 S31 0 DR
J_A1335 N182 P_Enable P247 DR
J_B621 P247 S30 0 DR
J_A1336 N003 CLK P248 DR
J_A1913 N001 !P_Enable 0 DR
R2989 VDD N001 50k
J_A1914 VDD N001 P249 DR
R2990 P249 N002 1k
R2991 N002 VSS 4.5k
R3940 VDD PC_INC 100k
J_F995 VDD PC_INC P250 DR
R3941 P250 N006 1k
R3942 N006 VSS 4.8k
J_A2425 N004 N006 0 DR
R3943 VDD N004 50k
J_F996 VDD N004 P251 DR
R3944 P251 N007 1k
R3945 N007 VSS 4.5k
J_A2426 P248 N007 0 DR
J_A1 N014 N019 0 DR
R1 VDD N014 50k
J_F1 VDD N014 P252 DR
R2 P252 N020 1k
R3 N020 VSS 4.5k
J_A2 N016 N020 0 DR
R4 VDD N016 50k
J_F2 VDD N016 P253 DR
R5 P253 S30 1k
R6 S30 VSS 4.5k
J_A3 N094 PC_Jin_Loading P254 DR
J_B1 P254 Scratch_3_High 0 DR
J_A4 N126 PC_Jin_Loading P255 DR
J_B2 P255 Scratch_2_High 0 DR
J_A5 N155 PC_Jin_Loading P256 DR
J_B3 P256 Scratch_1_High 0 DR
J_A6 N179 PC_Jin_Loading P257 DR
J_B4 P257 Scratch_0_High 0 DR
R7 VDD PC_Lower_IR_Load 100k
J_F3 VDD PC_Lower_IR_Load P258 DR
R8 P258 N092 1k
R9 N092 VSS 4.8k
J_A7 N087 N092 0 DR
R10 VDD N087 50k
J_A8 VDD N087 P259 DR
R11 P259 PC_Lower_IR_Loading 1k
R12 PC_Lower_IR_Loading VSS 4.5k
J_A9 PC_Lower_Load PC_Lower_IR_Loading 0 DR
J_A10 N097 PC_Jin_Loading P260 DR
J_B5 P260 Scratch_3_Lower 0 DR
J_A11 N129 PC_Jin_Loading P261 DR
J_B6 P261 Scratch_2_Lower 0 DR
J_A12 N156 PC_Jin_Loading P262 DR
J_B7 P262 Scratch_1_Lower 0 DR
J_A13 N182 PC_Jin_Loading P263 DR
J_B8 P263 Scratch_0_Lower 0 DR
J_A16 PC_Lower_Load PC_Jin_Loading 0 DR
.model NJF NJF
.model PJF PJF
.lib standard.jft
.backanno
.end